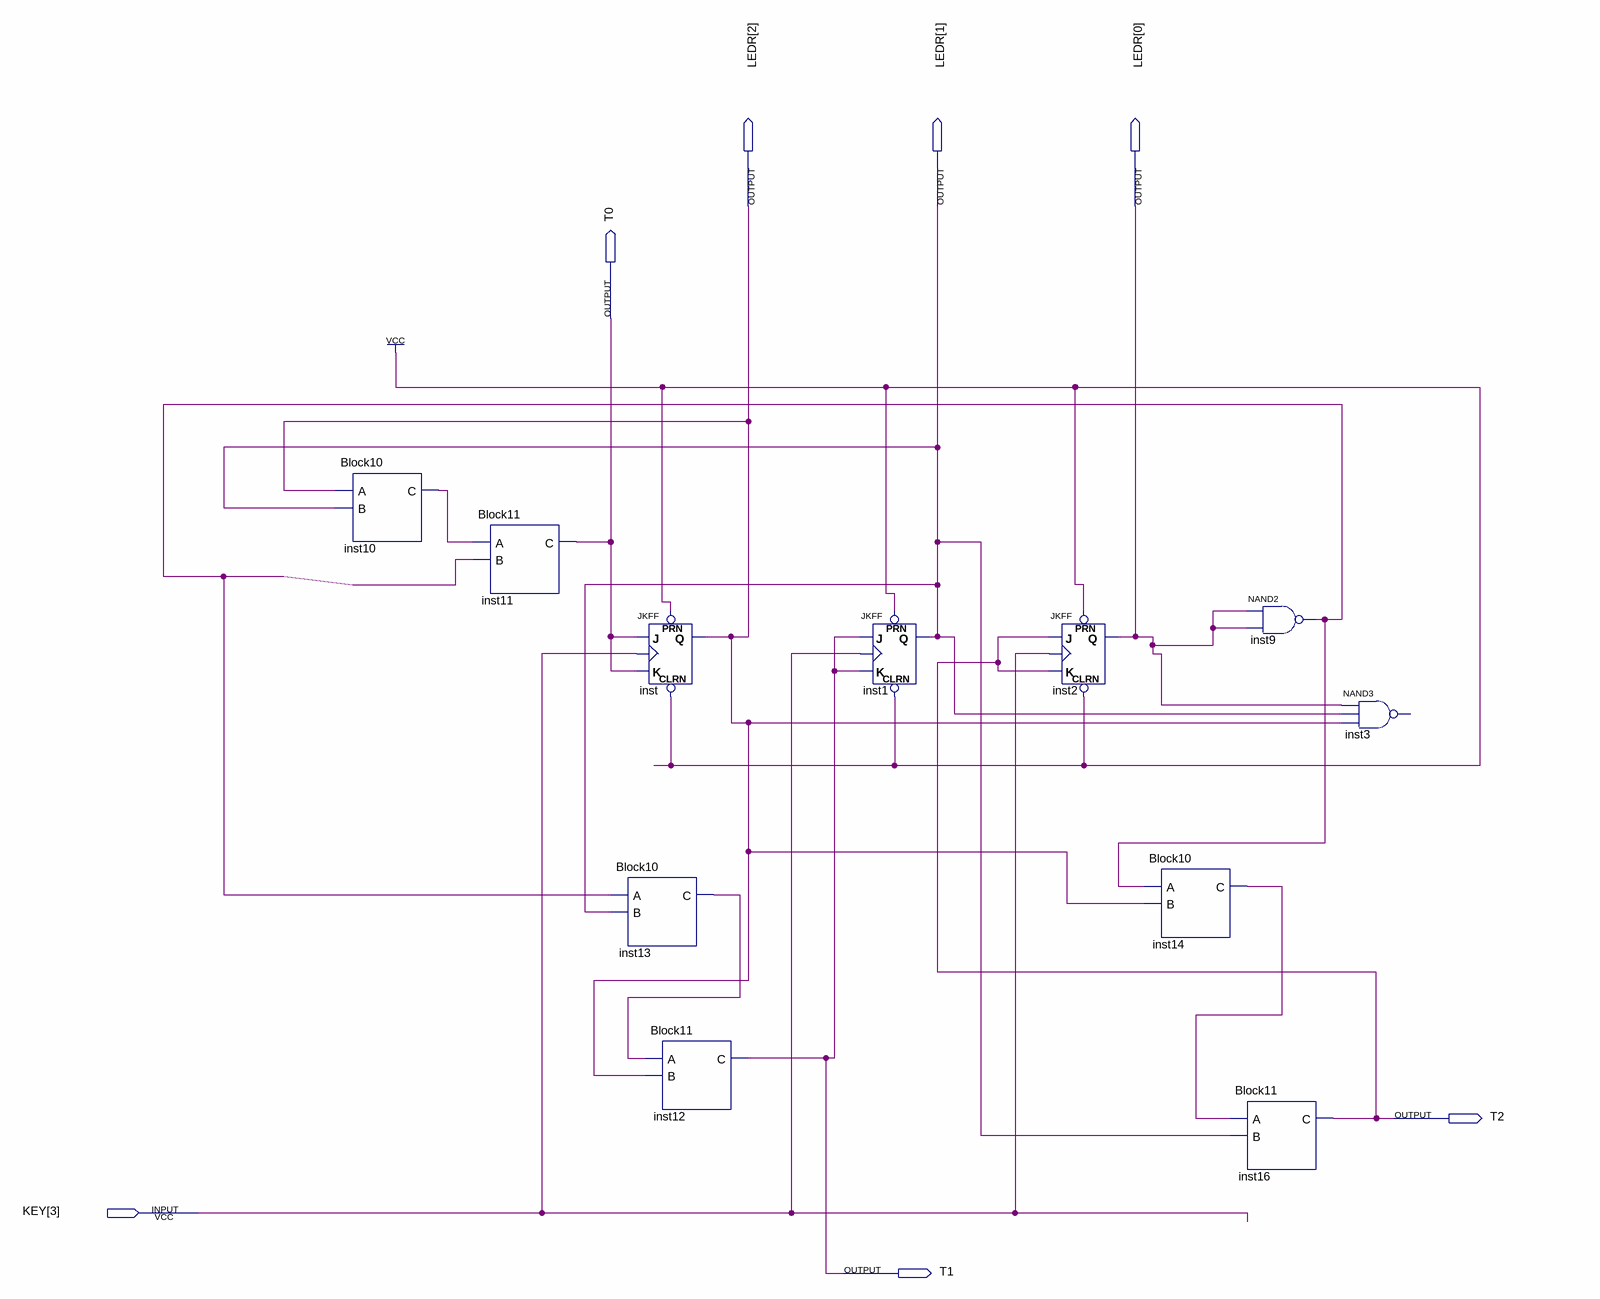
[diagram p0: schematic sheet]
// Quartus schematic Block9.bdf as structural Verilog: 11 symbols, 7 pins
module Block9 (
  input  [3:3] KEY,
  output [2:0] LEDR,
  output T0,
  output T2,
  output T1
);

  wire inst9_out, inst10_c, inst13_c, inst14_c;

  Block10 inst10 (.A(LEDR[2]), .B(LEDR[1]), .C(inst10_c));
  Block11 inst11 (.A(inst10_c), .B(inst9_out), .C(T0));
  JKFF inst (.PRN(1'b1), .CLRN(1'b1), .K(T0), .J(T0), .CLK(KEY[3]), .Q(LEDR[2]));
  Block10 inst13 (.A(inst9_out), .B(LEDR[1]), .C(inst13_c));
  Block11 inst12 (.A(inst13_c), .B(LEDR[2]), .C(T1));
  JKFF inst1 (.PRN(1'b1), .CLRN(1'b1), .K(T1), .J(T1), .CLK(KEY[3]), .Q(LEDR[1]));
  JKFF inst2 (.PRN(1'b1), .CLRN(1'b1), .K(T2), .J(T2), .CLK(KEY[3]), .Q(LEDR[0]));
  Block10 inst14 (.A(inst9_out), .B(LEDR[2]), .C(inst14_c));
  nand inst9 (inst9_out, LEDR[0], LEDR[0]);
  Block11 inst16 (.A(inst14_c), .B(LEDR[1]), .C(T2));
  // NAND3 inst3 has open pins: IN1=LEDR[0], IN2=LEDR[1], IN3=LEDR[2], OUT=open
endmodule
